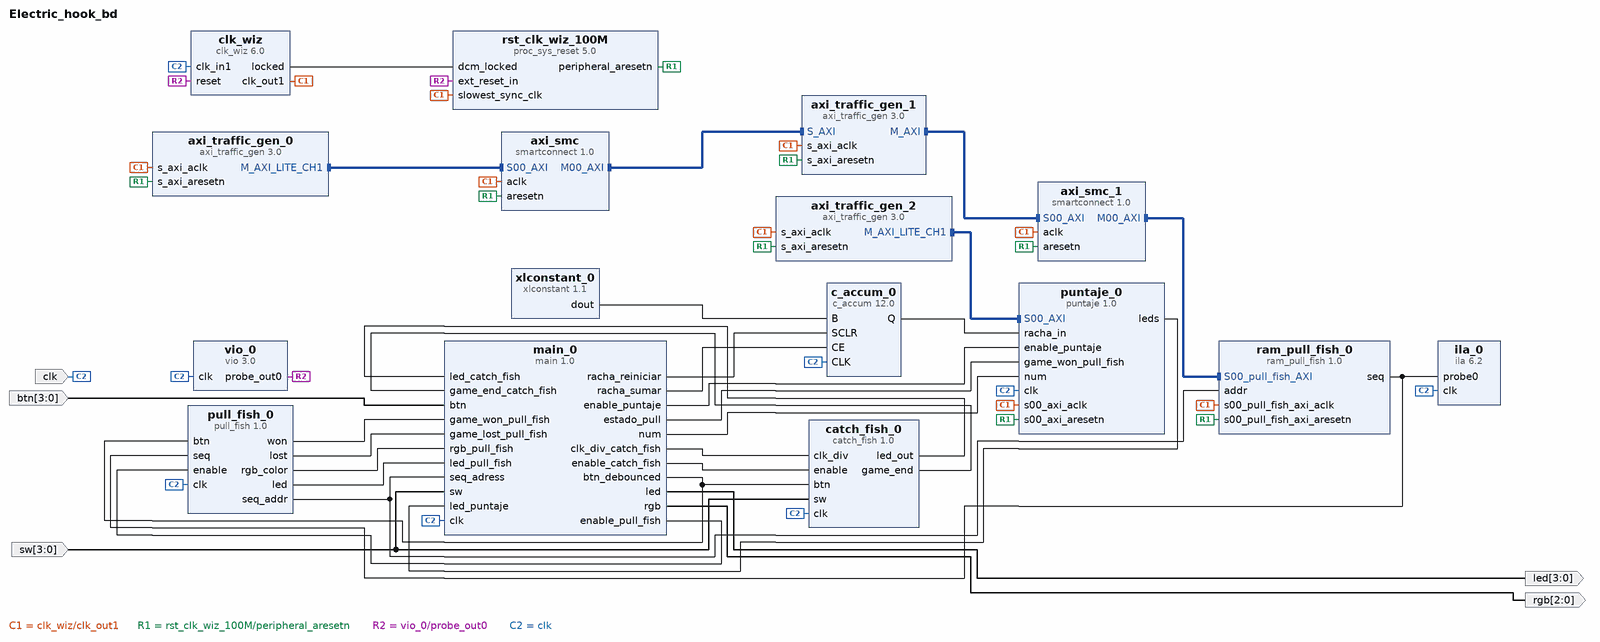
[diagram p0: block diagram of the top level]
# Vivado block design Electric_hook_bd, xc7z010clg400-1, Vivado 2020.1
create_bd_design Electric_hook_bd

create_bd_port -dir I -type clk clk
set_property -dict {CONFIG.FREQ_HZ 100000000} [get_bd_ports clk]
create_bd_port -dir I -from 3 -to 0 btn
create_bd_port -dir I -from 3 -to 0 sw
create_bd_port -dir O -from 3 -to 0 led
create_bd_port -dir O -from 2 -to 0 rgb

create_bd_cell -type ip -vlnv xilinx.com:user:ram_pull_fish:1.0 ram_pull_fish_0
create_bd_cell -type ip -vlnv xilinx.com:ip:axi_traffic_gen:3.0 axi_traffic_gen_0
set_property -dict [list \
  CONFIG.C_ATG_MIF_DATA_DEPTH 32 \
  CONFIG.C_ATG_MODE AXI4-Lite \
  CONFIG.C_ATG_SYSINIT_MODES System_Test \
  CONFIG.C_ATG_SYSTEM_CMD_MAX_RETRY 2147483647 \
  CONFIG.C_ATG_SYSTEM_INIT_ADDR_MIF ../../../../../../../Ip_cores/coe_files_pull_fish/addr.coe \
  CONFIG.C_ATG_SYSTEM_INIT_CTRL_MIF ../../../../../../../Ip_cores/coe_files_pull_fish/ctrl.coe \
  CONFIG.C_ATG_SYSTEM_INIT_DATA_MIF ../../../../../../../Ip_cores/coe_files_pull_fish/data.coe \
  CONFIG.C_ATG_SYSTEM_INIT_MASK_MIF ../../../../../../../Ip_cores/coe_files_pull_fish/mask.coe \
] [get_bd_cells axi_traffic_gen_0]
create_bd_cell -type ip -vlnv xilinx.com:ip:axi_traffic_gen:3.0 axi_traffic_gen_1
create_bd_cell -type ip -vlnv xilinx.com:ip:smartconnect:1.0 axi_smc
set_property -dict {CONFIG.NUM_SI 1} [get_bd_cells axi_smc]
create_bd_cell -type ip -vlnv xilinx.com:ip:clk_wiz:6.0 clk_wiz
set_property -dict [list \
  CONFIG.CLKIN1_JITTER_PS 100.0 \
  CONFIG.CLKOUT1_JITTER 130.958 \
  CONFIG.CLKOUT1_PHASE_ERROR 98.575 \
  CONFIG.MMCM_CLKFBOUT_MULT_F 10.000 \
  CONFIG.MMCM_CLKIN1_PERIOD 10.000 \
  CONFIG.PRIM_IN_FREQ 100.000 \
] [get_bd_cells clk_wiz]
create_bd_cell -type ip -vlnv xilinx.com:ip:proc_sys_reset:5.0 rst_clk_wiz_100M
create_bd_cell -type ip -vlnv xilinx.com:ip:smartconnect:1.0 axi_smc_1
set_property -dict {CONFIG.NUM_SI 1} [get_bd_cells axi_smc_1]
create_bd_cell -type ip -vlnv xilinx.com:user:catch_fish:1.0 catch_fish_0
create_bd_cell -type ip -vlnv xilinx.com:ip:vio:3.0 vio_0
set_property -dict {CONFIG.C_NUM_PROBE_IN 0} [get_bd_cells vio_0]
create_bd_cell -type ip -vlnv xilinx.com:ip:c_accum:12.0 c_accum_0
set_property -dict [list \
  CONFIG.Bypass false \
  CONFIG.CE true \
  CONFIG.Input_Type Unsigned \
  CONFIG.Input_Width 8 \
  CONFIG.Output_Width 8 \
  CONFIG.SCLR true \
] [get_bd_cells c_accum_0]
create_bd_cell -type ip -vlnv xilinx.com:ip:xlconstant:1.1 xlconstant_0
set_property -dict {CONFIG.CONST_WIDTH 8} [get_bd_cells xlconstant_0]
create_bd_cell -type ip -vlnv xilinx.com:user:puntaje:1.0 puntaje_0
create_bd_cell -type ip -vlnv xilinx.com:ip:axi_traffic_gen:3.0 axi_traffic_gen_2
set_property -dict [list \
  CONFIG.C_ATG_MODE AXI4-Lite \
  CONFIG.C_ATG_SYSINIT_MODES System_Test \
  CONFIG.C_ATG_SYSTEM_CMD_MAX_RETRY 2147483647 \
  CONFIG.C_ATG_SYSTEM_INIT_ADDR_MIF ../../../../../../../COE/COE_FILES/addr.coe \
  CONFIG.C_ATG_SYSTEM_INIT_CTRL_MIF ../../../../../../../COE/COE_FILES/ctrl.coe \
  CONFIG.C_ATG_SYSTEM_INIT_DATA_MIF ../../../../../../../COE/COE_FILES/data.coe \
  CONFIG.C_ATG_SYSTEM_INIT_MASK_MIF ../../../../../../../COE/COE_FILES/mask.coe \
] [get_bd_cells axi_traffic_gen_2]
create_bd_cell -type ip -vlnv xilinx.com:user:main:1.0 main_0
create_bd_cell -type ip -vlnv xilinx.com:ip:ila:6.2 ila_0
set_property -dict [list \
  CONFIG.C_ENABLE_ILA_AXI_MON false \
  CONFIG.C_MONITOR_TYPE Native \
  CONFIG.C_NUM_OF_PROBES 1 \
  CONFIG.C_PROBE0_WIDTH 16 \
] [get_bd_cells ila_0]
create_bd_cell -type ip -vlnv xilinx.com:user:pull_fish:1.0 pull_fish_0

# ---- connections ----

connect_bd_intf_net [get_bd_intf_pins axi_smc_1/M00_AXI] [get_bd_intf_pins ram_pull_fish_0/S00_pull_fish_AXI]
connect_bd_intf_net [get_bd_intf_pins axi_traffic_gen_0/M_AXI_LITE_CH1] [get_bd_intf_pins axi_smc/S00_AXI]
connect_bd_intf_net [get_bd_intf_pins axi_traffic_gen_2/M_AXI_LITE_CH1] [get_bd_intf_pins puntaje_0/S00_AXI]
connect_bd_intf_net [get_bd_intf_pins axi_traffic_gen_1/M_AXI] [get_bd_intf_pins axi_smc_1/S00_AXI]
connect_bd_intf_net [get_bd_intf_pins axi_smc/M00_AXI] [get_bd_intf_pins axi_traffic_gen_1/S_AXI]
connect_bd_net [get_bd_pins clk_wiz/clk_out1] \
  [get_bd_pins axi_traffic_gen_0/s_axi_aclk] [get_bd_pins axi_smc/aclk] [get_bd_pins rst_clk_wiz_100M/slowest_sync_clk] \
  [get_bd_pins axi_traffic_gen_1/s_axi_aclk] [get_bd_pins axi_smc_1/aclk] \
  [get_bd_pins ram_pull_fish_0/s00_pull_fish_axi_aclk] [get_bd_pins axi_traffic_gen_2/s_axi_aclk] \
  [get_bd_pins puntaje_0/s00_axi_aclk]
connect_bd_net [get_bd_pins clk_wiz/locked] [get_bd_pins rst_clk_wiz_100M/dcm_locked]
connect_bd_net [get_bd_pins rst_clk_wiz_100M/peripheral_aresetn] \
  [get_bd_pins axi_traffic_gen_0/s_axi_aresetn] [get_bd_pins axi_traffic_gen_1/s_axi_aresetn] [get_bd_pins axi_smc/aresetn] \
  [get_bd_pins ram_pull_fish_0/s00_pull_fish_axi_aresetn] [get_bd_pins axi_smc_1/aresetn] \
  [get_bd_pins axi_traffic_gen_2/s_axi_aresetn] [get_bd_pins puntaje_0/s00_axi_aresetn]
connect_bd_net -net reset_0_1 [get_bd_pins vio_0/probe_out0] [get_bd_pins clk_wiz/reset] [get_bd_pins rst_clk_wiz_100M/ext_reset_in]
connect_bd_net -net clk_in1_0_1 [get_bd_ports clk] \
  [get_bd_pins clk_wiz/clk_in1] [get_bd_pins catch_fish_0/clk] [get_bd_pins vio_0/clk] [get_bd_pins puntaje_0/clk] \
  [get_bd_pins main_0/clk] [get_bd_pins c_accum_0/CLK] [get_bd_pins pull_fish_0/clk] [get_bd_pins ila_0/clk]
connect_bd_net -net btn_0_1 [get_bd_ports btn] [get_bd_pins main_0/btn]
connect_bd_net -net sw_0_1 [get_bd_ports sw] [get_bd_pins catch_fish_0/sw] [get_bd_pins main_0/sw]
connect_bd_net [get_bd_pins main_0/led] [get_bd_ports led]
connect_bd_net [get_bd_pins main_0/rgb] [get_bd_ports rgb]
connect_bd_net [get_bd_pins main_0/clk_div_catch_fish] [get_bd_pins catch_fish_0/clk_div]
connect_bd_net [get_bd_pins main_0/enable_catch_fish] [get_bd_pins catch_fish_0/enable]
connect_bd_net [get_bd_pins main_0/btn_debounced] [get_bd_pins catch_fish_0/btn] [get_bd_pins pull_fish_0/btn]
connect_bd_net [get_bd_pins catch_fish_0/led_out] [get_bd_pins main_0/led_catch_fish]
connect_bd_net [get_bd_pins catch_fish_0/game_end] [get_bd_pins main_0/game_end_catch_fish]
connect_bd_net [get_bd_pins ram_pull_fish_0/seq] [get_bd_pins pull_fish_0/seq] [get_bd_pins ila_0/probe0]
connect_bd_net [get_bd_pins pull_fish_0/seq_addr] [get_bd_pins ram_pull_fish_0/addr] [get_bd_pins main_0/seq_adress]
connect_bd_net [get_bd_pins pull_fish_0/won] [get_bd_pins main_0/game_won_pull_fish]
connect_bd_net [get_bd_pins pull_fish_0/lost] [get_bd_pins main_0/game_lost_pull_fish]
connect_bd_net [get_bd_pins main_0/enable_pull_fish] [get_bd_pins pull_fish_0/enable]
connect_bd_net [get_bd_pins pull_fish_0/rgb_color] [get_bd_pins main_0/rgb_pull_fish]
connect_bd_net [get_bd_pins pull_fish_0/led] [get_bd_pins main_0/led_pull_fish]
connect_bd_net [get_bd_pins main_0/enable_puntaje] [get_bd_pins puntaje_0/enable_puntaje]
connect_bd_net [get_bd_pins main_0/estado_pull] [get_bd_pins puntaje_0/game_won_pull_fish]
connect_bd_net [get_bd_pins main_0/num] [get_bd_pins puntaje_0/num]
connect_bd_net [get_bd_pins c_accum_0/Q] [get_bd_pins puntaje_0/racha_in]
connect_bd_net [get_bd_pins puntaje_0/leds] [get_bd_pins main_0/led_puntaje]
connect_bd_net [get_bd_pins main_0/racha_reiniciar] [get_bd_pins c_accum_0/SCLR]
connect_bd_net [get_bd_pins main_0/racha_sumar] [get_bd_pins c_accum_0/CE]
connect_bd_net [get_bd_pins xlconstant_0/dout] [get_bd_pins c_accum_0/B]

# ---- address map ----
assign_bd_address -offset 0x44A00000 -range 64K -target_address_space [get_bd_addr_spaces axi_traffic_gen_0/Reg1] [get_bd_addr_segs axi_traffic_gen_1/S_AXI/Reg0]
assign_bd_address -offset 0x76000000 -range 64K -target_address_space [get_bd_addr_spaces axi_traffic_gen_1/Data] [get_bd_addr_segs ram_pull_fish_0/S00_pull_fish_AXI/S00_pull_fish_AXI_mem]
assign_bd_address -offset 0x44A00000 -range 64K -target_address_space [get_bd_addr_spaces axi_traffic_gen_2/Reg1] [get_bd_addr_segs puntaje_0/S00_AXI/S00_AXI_reg]

validate_bd_design
save_bd_design
